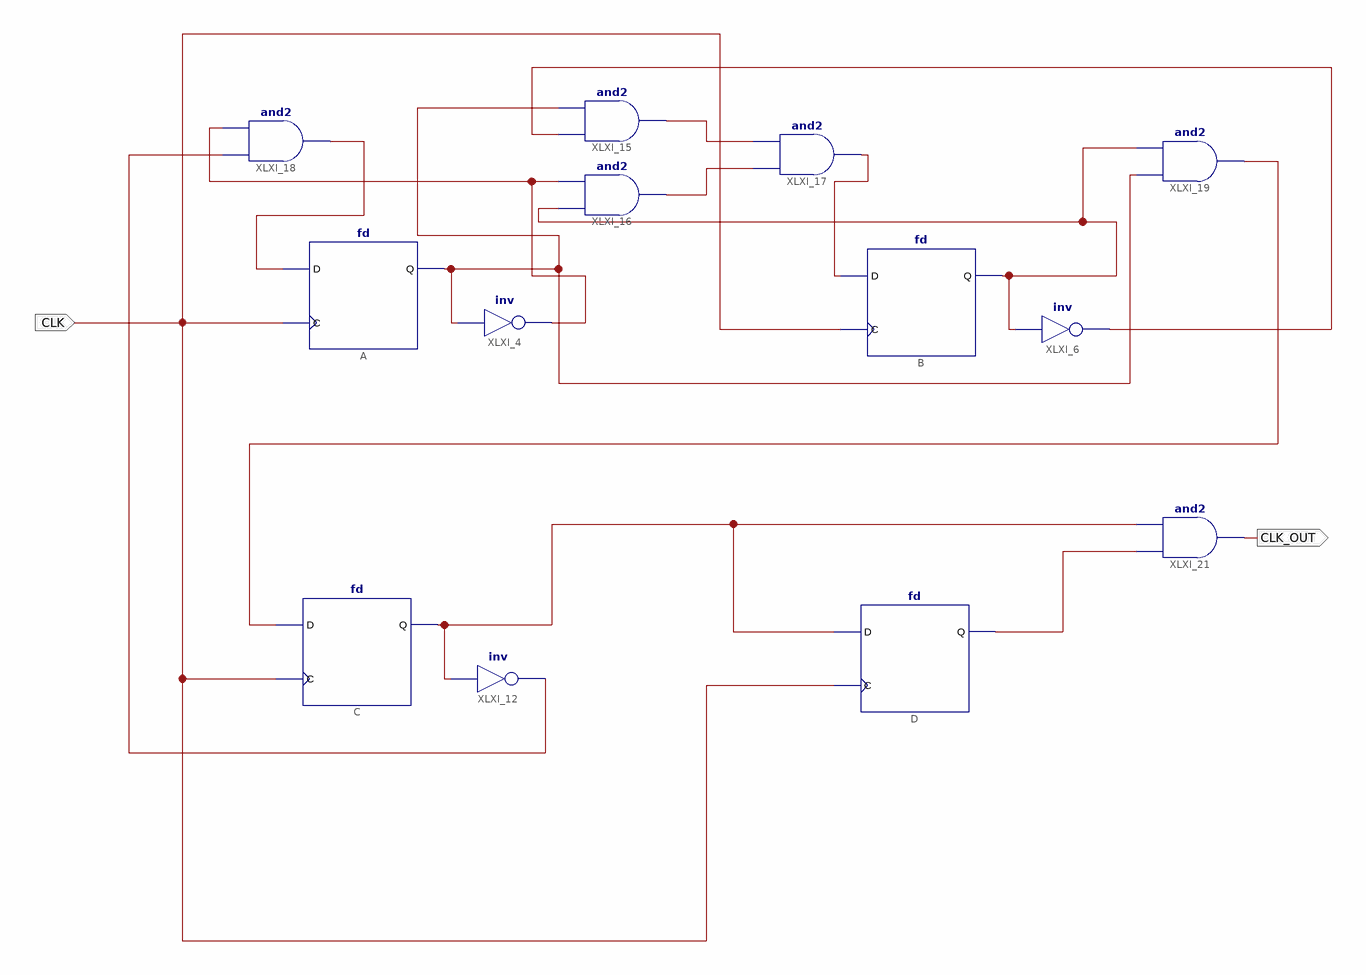
[diagram p0: schematic sheet 1]
// Xilinx ISE schematic divider5.sch (spartan6) as structural Verilog: 13 symbols, 2 ports
module divider5 (
  input  CLK,
  output CLK_OUT
);

  wire XLXN_20, XLXN_21, XLXN_22, XLXN_23, XLXN_27, XLXN_31, XLXN_32, XLXN_33, XLXN_35, XLXN_36, XLXN_38,
       XLXN_40;

  fd A (.C(CLK), .D(XLXN_23), .Q(XLXN_22));
  not XLXI_4 (XLXN_31, XLXN_22);
  fd B (.C(CLK), .D(XLXN_27), .Q(XLXN_35));
  not XLXI_6 (XLXN_33, XLXN_35);
  fd C (.C(CLK), .D(XLXN_36), .Q(XLXN_38));
  not XLXI_12 (XLXN_32, XLXN_38);
  fd D (.C(CLK), .D(XLXN_38), .Q(XLXN_40));
  and XLXI_15 (XLXN_20, XLXN_33, XLXN_22);
  and XLXI_16 (XLXN_21, XLXN_35, XLXN_31);
  and XLXI_17 (XLXN_27, XLXN_21, XLXN_20);
  and XLXI_18 (XLXN_23, XLXN_32, XLXN_31);
  and XLXI_19 (XLXN_36, XLXN_22, XLXN_35);
  and XLXI_21 (CLK_OUT, XLXN_40, XLXN_38);
endmodule
